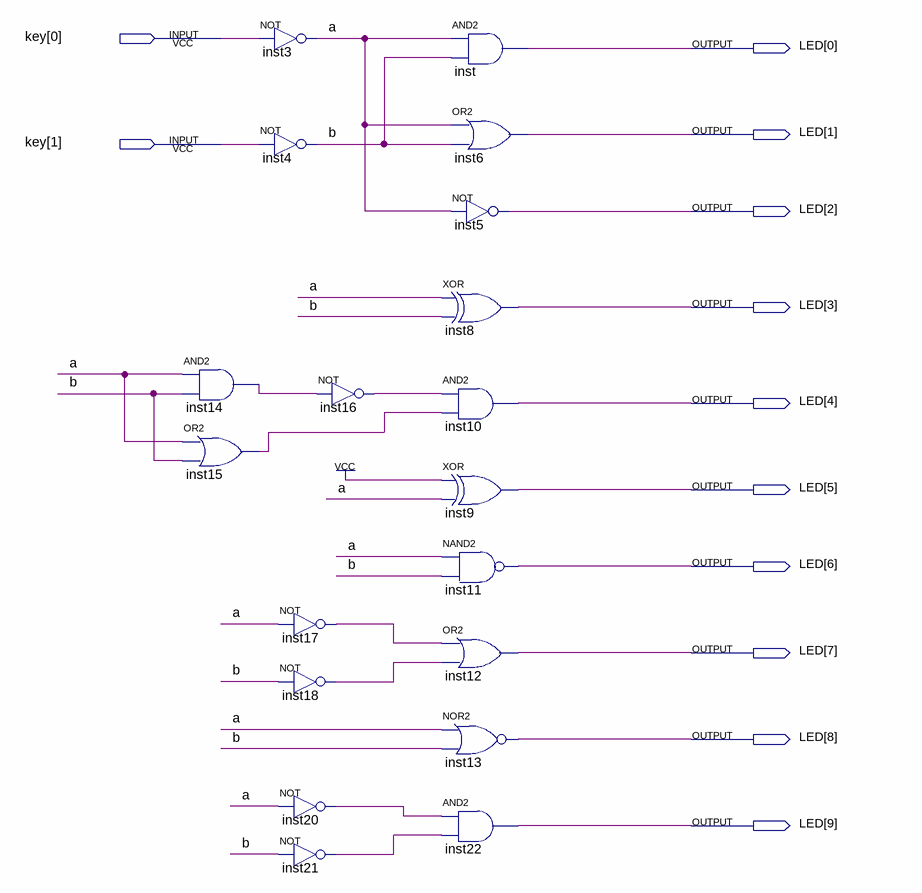
[diagram p0: schematic sheet]
// Quartus schematic lab_1.bdf as structural Verilog: 19 symbols, 12 pins
module lab_1 (
  input  [1:0] key,
  output [9:0] LED
);

  wire a, b, inst14_out, inst15_out, inst16_out, inst17_out, inst18_out, inst20_out, inst21_out;

  and inst14 (inst14_out, a, b);
  or inst15 (inst15_out, a, b);
  not inst3 (a, key[0]);
  not inst4 (b, key[1]);
  not inst16 (inst16_out, inst14_out);
  not inst17 (inst17_out, a);
  not inst18 (inst18_out, b);
  not inst20 (inst20_out, a);
  not inst21 (inst21_out, b);
  and inst (LED[0], a, b);
  or inst6 (LED[1], a, b);
  not inst5 (LED[2], a);
  xor inst8 (LED[3], a, b);
  and inst10 (LED[4], inst16_out, inst15_out);
  xor inst9 (LED[5], 1'b1, a);
  nand inst11 (LED[6], a, b);
  or inst12 (LED[7], inst17_out, inst18_out);
  nor inst13 (LED[8], a, b);
  and inst22 (LED[9], inst20_out, inst21_out);
endmodule
